# Altium schematic sheet FE.SchDoc: ThunderScope 1000E
size A4; Revision: 1
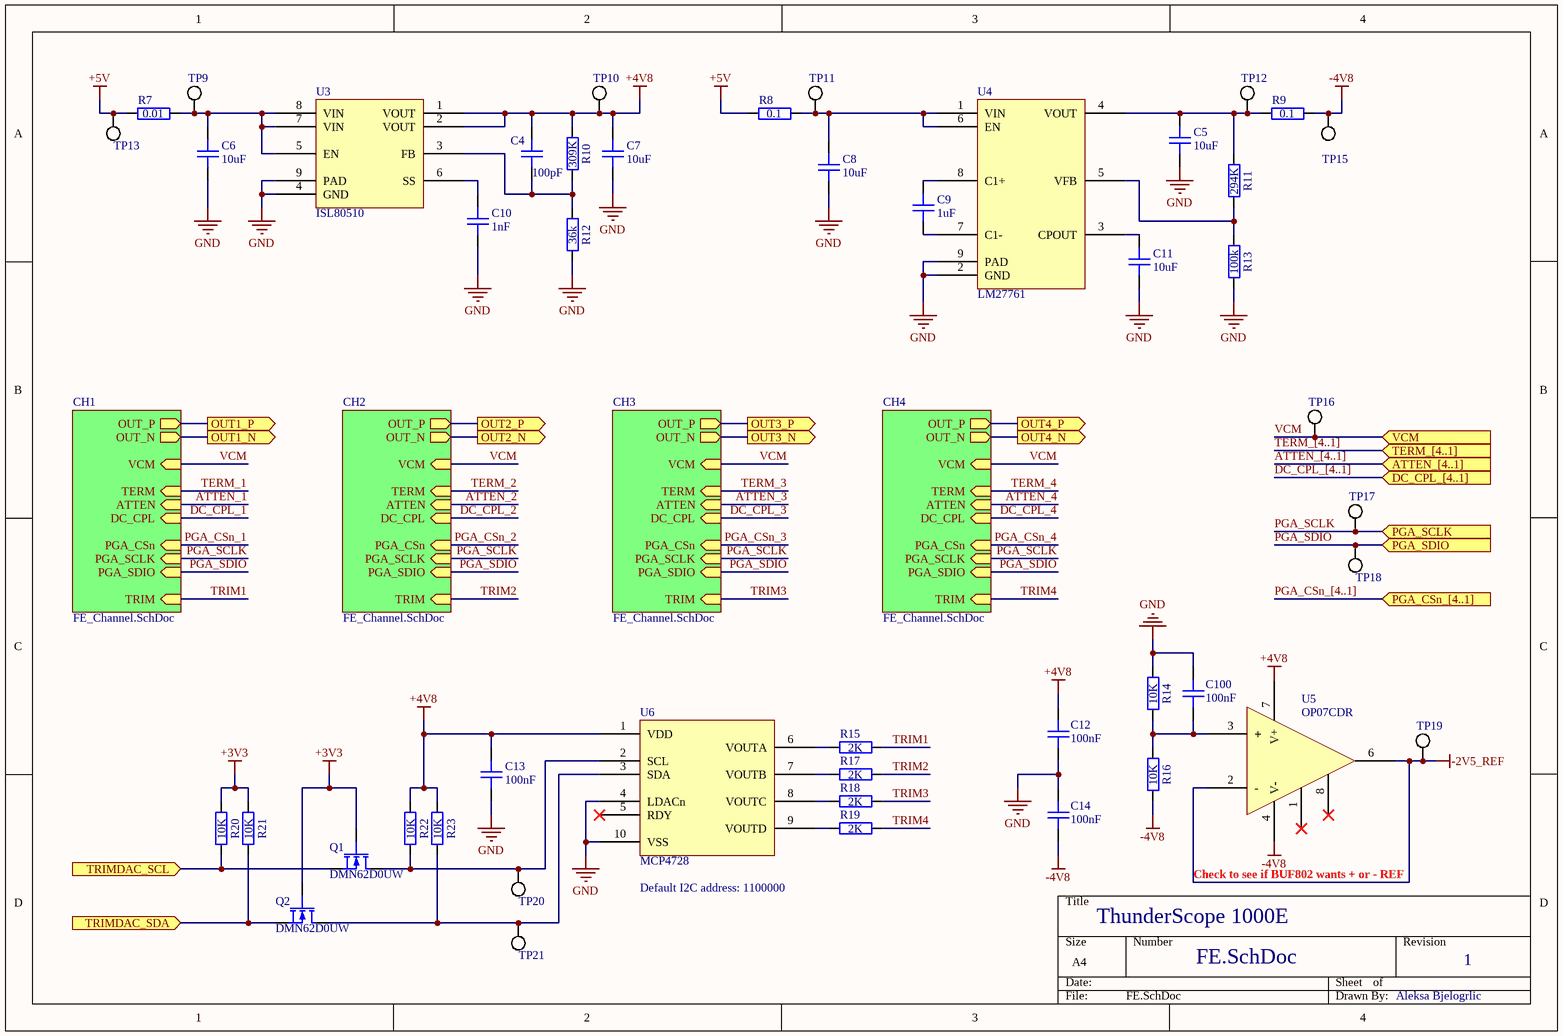
[diagram p0: FE.SchDoc]

## Parts
C4  100pF  [GEN_C_0402]
C5  10uF  [GEN_C_0603]
C6  10uF  [GEN_C_0603]
C7  10uF  [GEN_C_0603]
C8  10uF  [GEN_C_0603]
C9  1uF  [GEN_C_0402]
C10  1nF  [GEN_C_0402]
C11  10uF  [GEN_C_0603]
C12  100nF  [GEN_C_0402]
C13  100nF  [GEN_C_0402]
C14  100nF  [GEN_C_0402]
C100  100nF  [GEN_C_0402]
Q1  DMN62D0UW  [GEN_SOT_323]
Q2  DMN62D0UW  [GEN_SOT_323]
R7  0.01  [GEN_R_0603]
R8  0.1  [GEN_R_0402]
R9  0.1  [GEN_R_0402]
R10  309K  [GEN_R_0402]
R11  294K  [GEN_R_0402]
R12  36k  [GEN_R_0402]
R13  100k  [GEN_R_0402]
R14  10K  [GEN_R_0402]
R15  2K  [GEN_R_0402]
R16  10K  [GEN_R_0402]
R17  2K  [GEN_R_0402]
R18  2K  [GEN_R_0402]
R19  2K  [GEN_R_0402]
R20  10K  [GEN_R_0402]
R21  10K  [GEN_R_0402]
R22  10K  [GEN_R_0402]
R23  10K  [GEN_R_0402]
TP9  PCB  [GEN_TP_PCB]  (value not drawn)  (no BOM)
TP10  PCB  [GEN_TP_PCB]  (value not drawn)  (no BOM)
TP11  PCB  [GEN_TP_PCB]  (value not drawn)  (no BOM)
TP12  PCB  [GEN_TP_PCB]  (value not drawn)  (no BOM)
TP13  PCB  [GEN_TP_PCB]  (value not drawn)  (no BOM)
TP15  PCB  [GEN_TP_PCB]  (value not drawn)  (no BOM)
TP16  PCB  [GEN_TP_PCB]  (value not drawn)  (no BOM)
TP17  PCB  [GEN_TP_PCB]  (value not drawn)  (no BOM)
TP18  PCB  [GEN_TP_PCB]  (value not drawn)  (no BOM)
TP19  PCB  [GEN_TP_PCB]  (value not drawn)  (no BOM)
TP20  PCB  [GEN_TP_PCB]  (value not drawn)  (no BOM)
TP21  PCB  [GEN_TP_PCB]  (value not drawn)  (no BOM)
U3  ISL80510  [REN_DFN_ISL80510]
U4  LM27761  [TI_WSON8_DSG0008A]
U5  OP07CDR  [TI_SOIC8_D0008A]
U6  MCP4728  [MC_MSOP10_UN]

## Sub-sheets
CH1 = FE_Channel.SchDoc: OUT_P (out), VCM (in), OUT_N (out), TRIM (in), ATTEN (in), DC_CPL (in), PGA_CSn (in), PGA_SCLK (in), PGA_SDIO (in), TERM (in)
CH2 = FE_Channel.SchDoc: OUT_P (out), VCM (in), OUT_N (out), TRIM (in), ATTEN (in), DC_CPL (in), PGA_CSn (in), PGA_SCLK (in), PGA_SDIO (in), TERM (in)
CH3 = FE_Channel.SchDoc: OUT_P (out), VCM (in), OUT_N (out), TRIM (in), ATTEN (in), DC_CPL (in), PGA_CSn (in), PGA_SCLK (in), PGA_SDIO (in), TERM (in)
CH4 = FE_Channel.SchDoc: OUT_P (out), VCM (in), OUT_N (out), TRIM (in), ATTEN (in), DC_CPL (in), PGA_CSn (in), PGA_SCLK (in), PGA_SDIO (in), TERM (in)

## Ports
ATTEN_[4..1] (in), DC_CPL_[4..1] (in), OUT1_N (out), OUT1_P (out), OUT2_N (out), OUT2_P (out), OUT3_N (out), OUT3_P (out), OUT4_N (out), OUT4_P (out), PGA_CSn_[4..1] (in), PGA_SCLK (in), PGA_SDIO (in), TERM_[4..1] (in), TRIMDAC_SCL (in), TRIMDAC_SDA (in), VCM (in)

## Nets
+3V3: Q1.2(G) Q2.2(G) R20.2 R21.2
+4V8: C4.2 C7.2 C12.1 C13.2 R10.2 R22.2 R23.2 TP10.1 U3.1(VOUT) U3.2(VOUT) U5.7(V+) U6.1(VDD)
+5V: R7.1 R8.1 TP13.1
-2V5_REF: TP19.1 U5.2(-) U5.6(OUT)
-4V8: C14.2 R9.2 R16.1 TP15.1 U5.4(V-)
GND: C5.1 C6.1 C7.1 C8.1 C10.1 C11.1 C12.2 C13.1 C14.1 C100.1 R12.1 R13.1 R14.2 U3.4(GND) U3.9(PAD) U4.2(GND) U4.9(PAD) U6.4(LDACn) U6.10(VSS)
ATTEN_1: sheet CH1/ATTEN
ATTEN_2: sheet CH2/ATTEN
ATTEN_3: sheet CH3/ATTEN
ATTEN_4: sheet CH4/ATTEN
DC_CPL_1: sheet CH1/DC_CPL
DC_CPL_2: sheet CH2/DC_CPL
DC_CPL_3: sheet CH3/DC_CPL
DC_CPL_4: sheet CH4/DC_CPL
OUT1_N: port OUT1_N, sheet CH1/OUT_N
OUT1_P: port OUT1_P, sheet CH1/OUT_P
OUT2_N: port OUT2_N, sheet CH2/OUT_N
OUT2_P: port OUT2_P, sheet CH2/OUT_P
OUT3_N: port OUT3_N, sheet CH3/OUT_N
OUT3_P: port OUT3_P, sheet CH3/OUT_P
OUT4_N: port OUT4_N, sheet CH4/OUT_N
OUT4_P: port OUT4_P, sheet CH4/OUT_P
PGA_CSn_1: sheet CH1/PGA_CSn
PGA_CSn_2: sheet CH2/PGA_CSn
PGA_CSn_3: sheet CH3/PGA_CSn
PGA_CSn_4: sheet CH4/PGA_CSn
PGA_SCLK: TP17.1 ; port PGA_SCLK, sheet CH1/PGA_SCLK, sheet CH2/PGA_SCLK, sheet CH3/PGA_SCLK, sheet CH4/PGA_SCLK
PGA_SDIO: TP18.1 ; port PGA_SDIO, sheet CH1/PGA_SDIO, sheet CH2/PGA_SDIO, sheet CH3/PGA_SDIO, sheet CH4/PGA_SDIO
TERM_1: sheet CH1/TERM
TERM_2: sheet CH2/TERM
TERM_3: sheet CH3/TERM
TERM_4: sheet CH4/TERM
TRIM1: R15.1 ; sheet CH1/TRIM
TRIM2: R17.1 ; sheet CH2/TRIM
TRIM3: R18.1 ; sheet CH3/TRIM
TRIM4: R19.1 ; sheet CH4/TRIM
TRIMDAC_SCL: Q1.3(S) R20.1 ; port TRIMDAC_SCL
TRIMDAC_SDA: Q2.3(S) R21.1 ; port TRIMDAC_SDA
VCM: TP16.1 ; port VCM, sheet CH1/VCM, sheet CH2/VCM, sheet CH3/VCM, sheet CH4/VCM
NetC4_1: C4.1 R10.1 R12.2 U3.3(FB)
NetC5_2: C5.2 R9.1 R11.2 TP12.1 U4.4(VOUT)
NetC6_2: C6.2 R7.2 TP9.1 U3.5(EN) U3.7(VIN) U3.8(VIN)
NetC8_2: C8.2 R8.2 TP11.1 U4.1(VIN) U4.6(EN)
NetC9_1: C9.1 U4.7(C1-)
NetC9_2: C9.2 U4.8(C1+)
NetC10_2: C10.2 U3.6(SS)
NetC11_2: C11.2 U4.3(CPOUT)
NetC100_2: C100.2 R14.1 R16.2 U5.3(+)
NetQ1_1: Q1.1(D) R22.1 TP20.1 U6.2(SCL)
NetQ2_1: Q2.1(D) R23.1 TP21.1 U6.3(SDA)
NetR11_1: R11.1 R13.2 U4.5(VFB)
NetR15_2: R15.2 U6.6(VOUTA)
NetR17_2: R17.2 U6.7(VOUTB)
NetR18_2: R18.2 U6.8(VOUTC)
NetR19_2: R19.2 U6.9(VOUTD)

Not connected (* = marked no-connect by the designer): U5 1(N1)* 8(N2)*; U6 5(RDY)*

## Buses and harness runs
bus ATTEN_[4..1] = port ATTEN_[4..1]
bus DC_CPL_[4..1] = port DC_CPL_[4..1]
bus PGA_CSn_[4..1] = port PGA_CSn_[4..1]
bus TERM_[4..1] = port TERM_[4..1]

## Notes on the sheet
- Default I2C address: 1100000
- Check to see if BUF802 wants + or - REF
- Aleksa Bjelogrlic

## Library data of the parts
C4 = CAP 100pF 50V C0G 0402: Temperature Coefficient: C0G; Voltage Rating: 50V; Package: 0402; Value: 100pF; Supplier 1: Digi-Key; Supplier Part Number 1: 490-14349-1-ND
C5-C8 C11 = CAP 10uF 10V X5R 0603: Voltage Rating: 10V; Package: 0402; Supplier 1: Digi-Key; Supplier Part Number 1: 490-10474-1-ND; Value: 10uF
C9 = CAP 1uF 25V X5R 0402: Voltage Rating: 25V; Package: 0402; Supplier 1: Digi-Key; Supplier Part Number 1: 490-10017-1-ND; Value: 1uF
C10 = CAP 1nF 50V C0G 0402: Voltage Rating: 50V; Package: 0402; Supplier 1: Digi-Key; Supplier Part Number 1: 490-6189-1-ND; Value: 1nF
C12-C14 C100 = CAP 100nF 16V X7R 0402: Voltage Rating: 16V; Package: 0402; Supplier 1: Digi-Key; Supplier Part Number 1: 490-4759-1-ND; Value: 100nF
Q1 Q2 = NMOS DMN62D0UW: Vdss: 60V; Id: 340mA; Max Power: 320mW; Supplier 1: Digi-Key; Supplier Part Number 1: DMN62D0UW-7DICT-ND
R7 = RES 0.01 OHM 1% 1/4W 0603: Tolerance: 1%; Power Rating: 0.25W; Supplier 1: Digi-Key; Supplier Part Number 1: 408-1404-1-ND; Value: 0.01; Package: 0603
R8 R9 = RES 0.1 OHM 1% 1/6W 0402: Tolerance: 1%; Power Rating: 0.16W; Package: 0402; Supplier 1: Digi-Key; Supplier Part Number 1: P.10AKCT-ND; Value: 0.1
R10 = RES 309K OHM 1% 1/16W 0402: Tolerance: 1%; Power Rating: 0.0625W; Package: 0402; Value: 309K; Supplier 1: Digi-Key; Supplier Part Number 1: YAG3108CT-ND
R11 = RES 294K OHM 1% 1/16W 0402: Tolerance: 1%; Power Rating: 0.0625W; Package: 0402; Supplier 1: Digi-Key; Supplier Part Number 1: YAG3092CT-ND; Value: 294K
R12 = RES 36K OHM 1% 1/16W 0402: Tolerance: 1%; Power Rating: 0.0625W; Package: 0402; Value: 36k; Supplier 1: Digi-Key; Supplier Part Number 1: 311-36.0KLRCT-ND
R13 = RES 100K OHM 1% 1/10W 0402: Tolerance: 1%; Power Rating: 0.1W; Package: 0402; Supplier 1: Digi-Key; Supplier Part Number 1: 311-100KLRCT-ND; Value: 100k
R14 R16 R20-R23 = RES 10K OHM 1% 1/10W 0402: Tolerance: 1%; Power Rating: 0.1W; Package: 0402; Supplier 1: Digi-Key; Supplier Part Number 1: P10.0KLCT-ND; Value: 10K
R15 R17-R19 = RES 2K OHM 1% 1/16W 0402: Tolerance: 1%; Power Rating: 0.0625W; Package: 0402; Supplier 1: Digi-Key; Supplier Part Number 1: 311-2KLRCT-ND; Value: 2K
TP9-TP13 TP15-TP21 = TP PCB 1mm
U3 = IC LDO ISL80510: Supplier 1: Mouser; Supplier Part Number 1: 968-ISL80510IRAJZ-T7
U4 = IC CPUMP LM27761: Supplier 1: Digi-Key; Supplier Part Number 1: 296-44379-1-ND
U5 = IC OPAMP OP07CDR: Supplier 1: Digi-Key; Supplier Part Number 1: 296-14626-1-ND
U6 = IC DAC QUAD MCP4728: Supplier 1: Digi-Key; Supplier Part Number 1: MCP4728A1T-E/UNCT-ND